# Altium schematic sheet P08 Hi3531AV100(DDRC0 D.SchDoc
size 420 x 297 mm
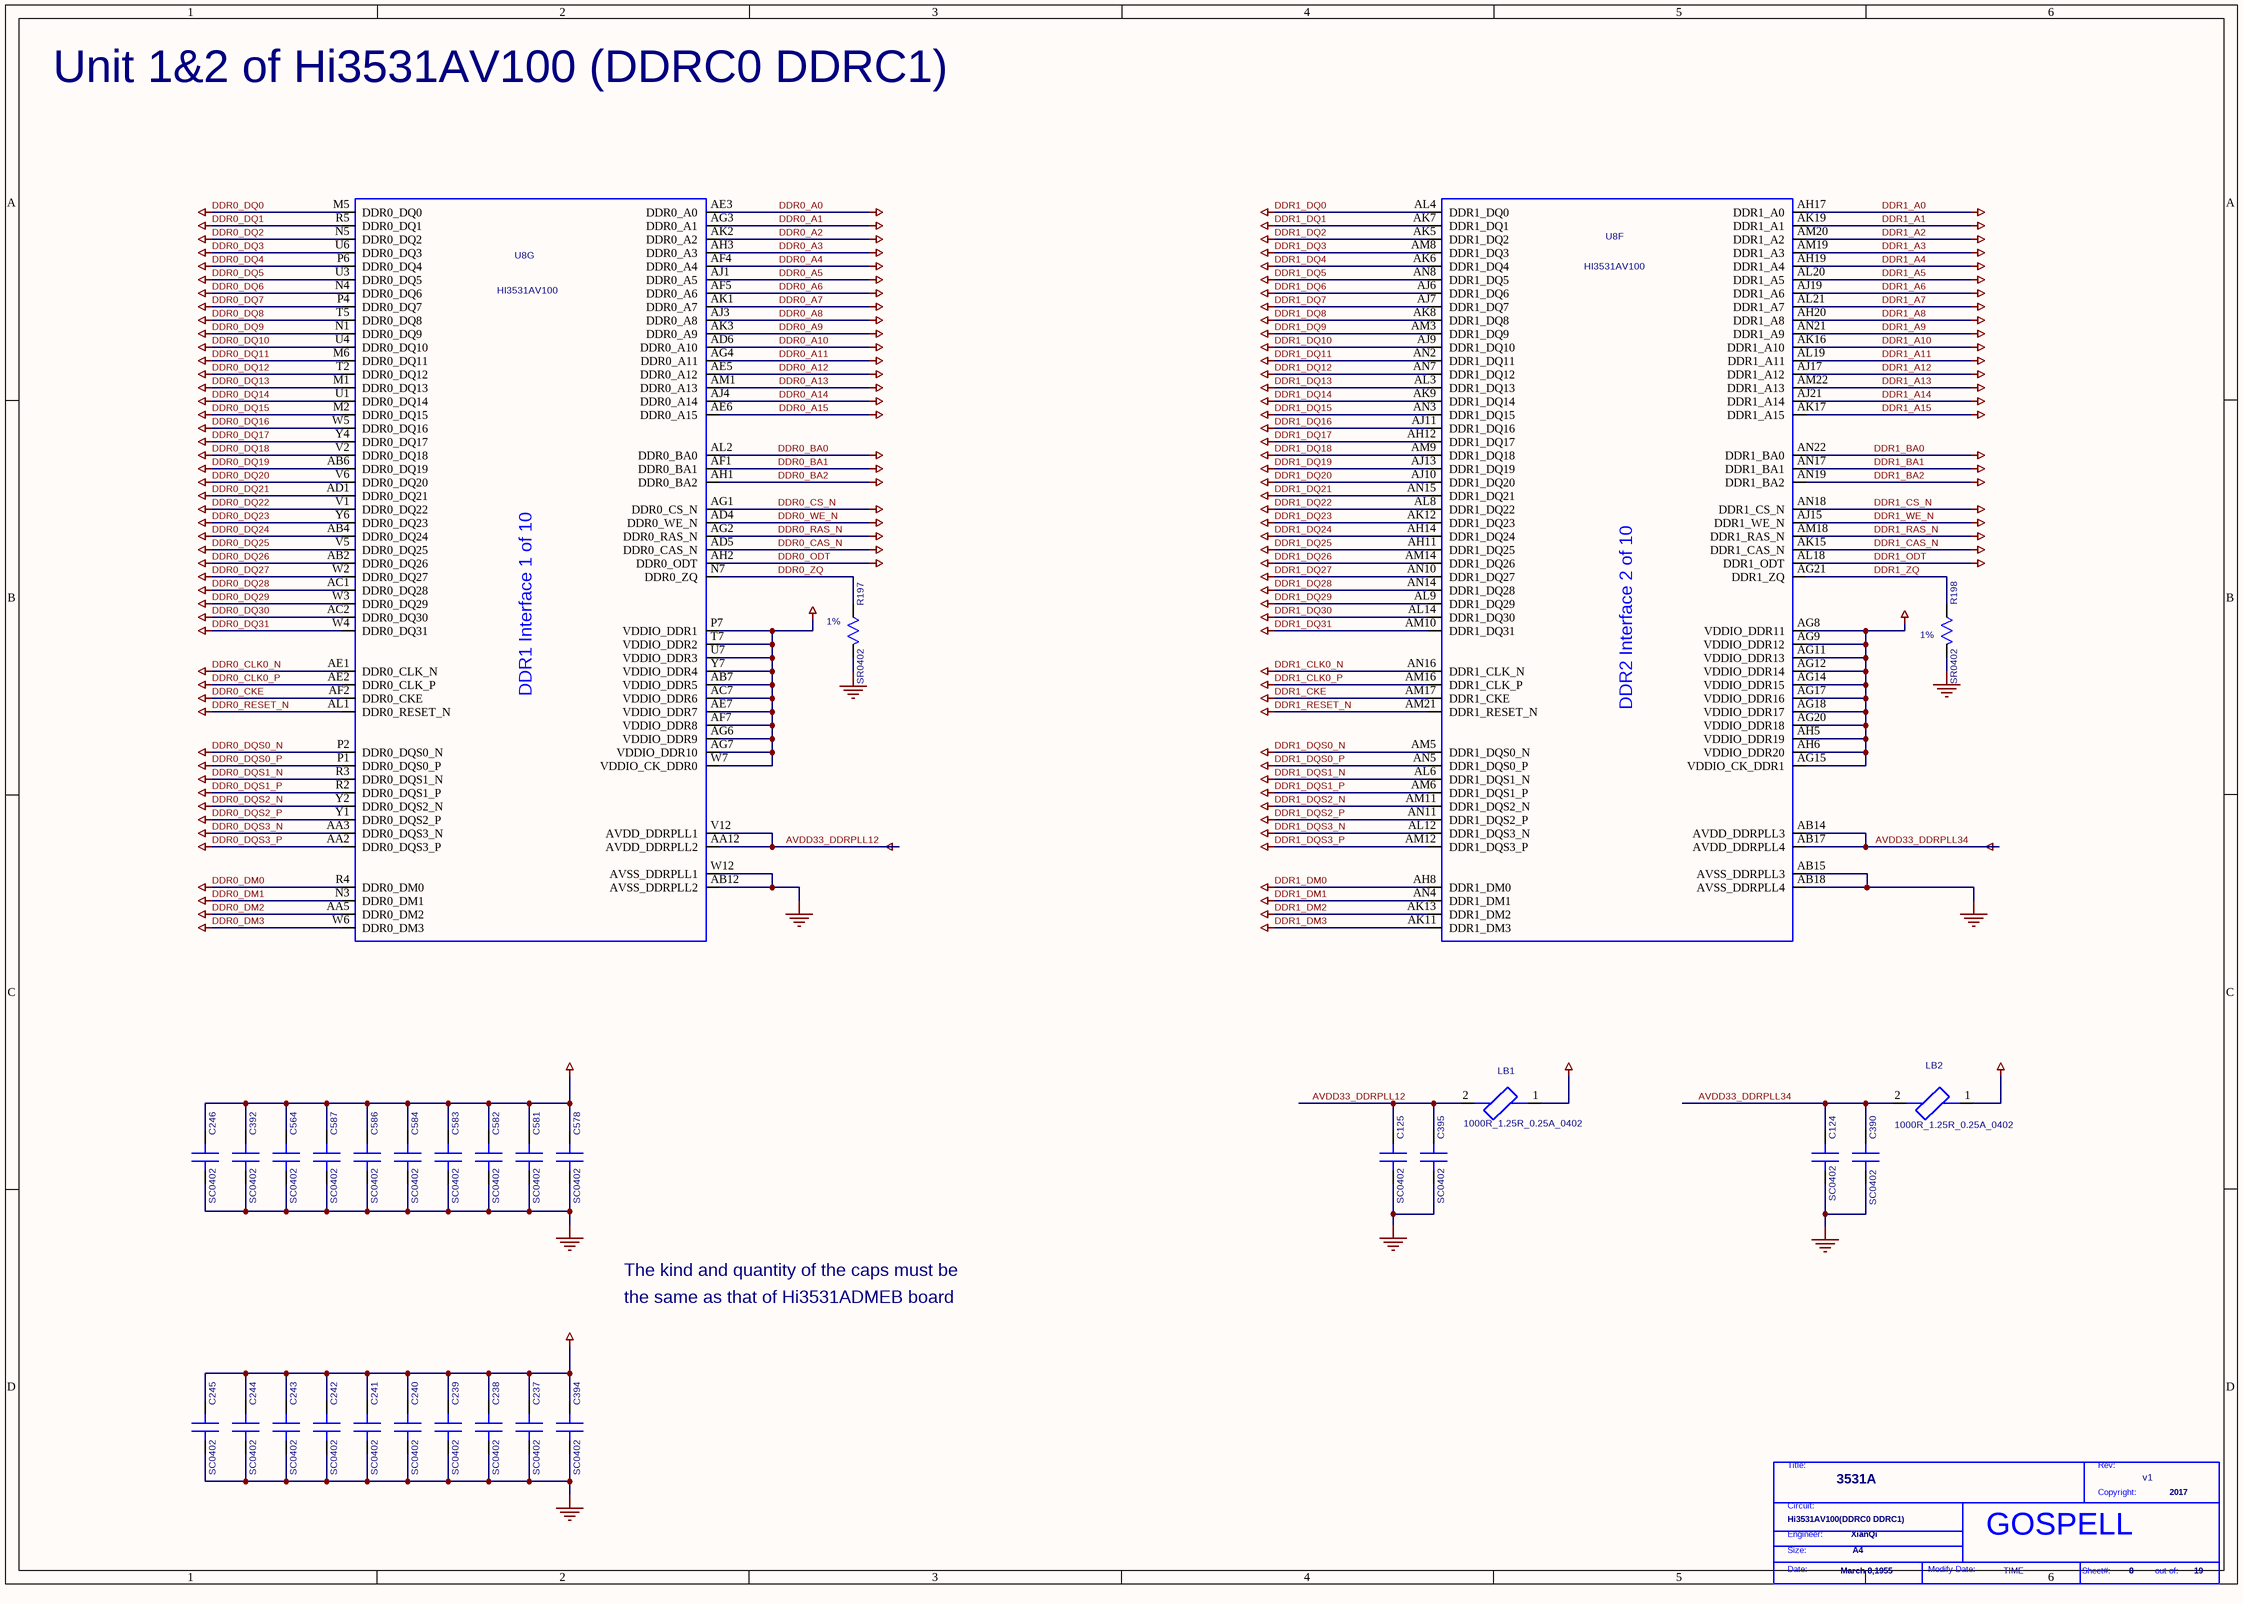
[diagram p0: P08 Hi3531AV100(DDRC0 D.SchDoc]

## Parts
*  Page Modify Date: TIME  Engineer: XianQi  Copyright: 2017  Title: 3531A  RevCode: v1  Page Size: A4  Page Create Date: March 8,1955  Page Number: 8  Page Count: 19  Doc: Hi3531AV100(DDRC0 DDRC1)  (hidden comment: GOSPELL)  (graphical)
C124  SC0402  [SC0402]
C125  SC0402  [SC0402]
C237  SC0402  [SC0402]
C238  SC0402  [SC0402]
C239  SC0402  [SC0402]
C240  SC0402  [SC0402]
C241  SC0402  [SC0402]
C242  SC0402  [SC0402]
C243  SC0402  [SC0402]
C244  SC0402  [SC0402]
C245  SC0402  [SC0402]
C246  SC0402  [SC0402]
C390  SC0402  [SC0402]
C392  SC0402  [SC0402]
C394  SC0402  [SC0402]
C395  SC0402  [SC0402]
C564  SC0402  [SC0402]
C578  SC0402  [SC0402]
C581  SC0402  [SC0402]
C582  SC0402  [SC0402]
C583  SC0402  [SC0402]
C584  SC0402  [SC0402]
C586  SC0402  [SC0402]
C587  SC0402  [SC0402]
LB1  SL0402  [SL0402]  (value not drawn)
LB2  SL0402  [SL0402]  (value not drawn)
R197  SR0402  [SR0402]
R198  SR0402  [SR0402]
U8  DEVICE: HI3531AV100  [BGA805-32-3333]  (hidden comment: BGA805-32-3333)  (parts F,G of 10)

## Nets
1V5: C237.1(A) C238.1(A) C239.1(A) C240.1(A) C241.1(A) C242.1(A) C243.1(A) C244.1(A) C245.1(A) C246.1(A) C392.1(A) C394.1(A) C564.1(A) C578.1(A) C581.1(A) C582.1(A) C583.1(A) C584.1(A) C586.1(A) C587.1(A) U8.AB7(VDDIO_DDR5) U8.AC7(VDDIO_DDR6) U8.AE7(VDDIO_DDR7) U8.AF7(VDDIO_DDR8) U8.AG6(VDDIO_DDR9) U8.AG7(VDDIO_DDR10) U8.AG8(VDDIO_DDR11) U8.AG9(VDDIO_DDR12) U8.AG11(VDDIO_DDR13) U8.AG12(VDDIO_DDR14) U8.AG14(VDDIO_DDR15) U8.AG15(VDDIO_CK_DDR1) U8.AG17(VDDIO_DDR16) U8.AG18(VDDIO_DDR17) U8.AG20(VDDIO_DDR18) U8.AH5(VDDIO_DDR19) U8.AH6(VDDIO_DDR20) U8.P7(VDDIO_DDR1) U8.T7(VDDIO_DDR2) U8.U7(VDDIO_DDR3) U8.W7(VDDIO_CK_DDR0) U8.Y7(VDDIO_DDR4)
3V3: LB1.1 LB2.1
AVDD33_DDRPLL12: C125.1(A) C395.1(A) LB1.2 U8.AA12(AVDD_DDRPLL2) U8.V12(AVDD_DDRPLL1)
AVDD33_DDRPLL34: C124.1(A) C390.1(A) LB2.2 U8.AB14(AVDD_DDRPLL3) U8.AB17(AVDD_DDRPLL4)
DDR0_A0: U8.AE3(DDR0_A0)
DDR0_A1: U8.AG3(DDR0_A1)
DDR0_A2: U8.AK2(DDR0_A2)
DDR0_A3: U8.AH3(DDR0_A3)
DDR0_A4: U8.AF4(DDR0_A4)
DDR0_A5: U8.AJ1(DDR0_A5)
DDR0_A6: U8.AF5(DDR0_A6)
DDR0_A7: U8.AK1(DDR0_A7)
DDR0_A8: U8.AJ3(DDR0_A8)
DDR0_A9: U8.AK3(DDR0_A9)
DDR0_A10: U8.AD6(DDR0_A10)
DDR0_A11: U8.AG4(DDR0_A11)
DDR0_A12: U8.AE5(DDR0_A12)
DDR0_A13: U8.AM1(DDR0_A13)
DDR0_A14: U8.AJ4(DDR0_A14)
DDR0_A15: U8.AE6(DDR0_A15)
DDR0_BA0: U8.AL2(DDR0_BA0)
DDR0_BA1: U8.AF1(DDR0_BA1)
DDR0_BA2: U8.AH1(DDR0_BA2)
DDR0_CAS_N: U8.AD5(DDR0_CAS_N)
DDR0_CKE: U8.AF2(DDR0_CKE)
DDR0_CLK0_N: U8.AE1(DDR0_CLK_N)
DDR0_CLK0_P: U8.AE2(DDR0_CLK_P)
DDR0_CS_N: U8.AG1(DDR0_CS_N)
DDR0_DM0: U8.R4(DDR0_DM0)
DDR0_DM1: U8.N3(DDR0_DM1)
DDR0_DM2: U8.AA5(DDR0_DM2)
DDR0_DM3: U8.W6(DDR0_DM3)
DDR0_DQ0: U8.M5(DDR0_DQ0)
DDR0_DQ1: U8.R5(DDR0_DQ1)
DDR0_DQ2: U8.N5(DDR0_DQ2)
DDR0_DQ3: U8.U6(DDR0_DQ3)
DDR0_DQ4: U8.P6(DDR0_DQ4)
DDR0_DQ5: U8.U3(DDR0_DQ5)
DDR0_DQ6: U8.N4(DDR0_DQ6)
DDR0_DQ7: U8.P4(DDR0_DQ7)
DDR0_DQ8: U8.T5(DDR0_DQ8)
DDR0_DQ9: U8.N1(DDR0_DQ9)
DDR0_DQ10: U8.U4(DDR0_DQ10)
DDR0_DQ11: U8.M6(DDR0_DQ11)
DDR0_DQ12: U8.T2(DDR0_DQ12)
DDR0_DQ13: U8.M1(DDR0_DQ13)
DDR0_DQ14: U8.U1(DDR0_DQ14)
DDR0_DQ15: U8.M2(DDR0_DQ15)
DDR0_DQ16: U8.W5(DDR0_DQ16)
DDR0_DQ17: U8.Y4(DDR0_DQ17)
DDR0_DQ18: U8.V2(DDR0_DQ18)
DDR0_DQ19: U8.AB6(DDR0_DQ19)
DDR0_DQ20: U8.V6(DDR0_DQ20)
DDR0_DQ21: U8.AD1(DDR0_DQ21)
DDR0_DQ22: U8.V1(DDR0_DQ22)
DDR0_DQ23: U8.Y6(DDR0_DQ23)
DDR0_DQ24: U8.AB4(DDR0_DQ24)
DDR0_DQ25: U8.V5(DDR0_DQ25)
DDR0_DQ26: U8.AB2(DDR0_DQ26)
DDR0_DQ27: U8.W2(DDR0_DQ27)
DDR0_DQ28: U8.AC1(DDR0_DQ28)
DDR0_DQ29: U8.W3(DDR0_DQ29)
DDR0_DQ30: U8.AC2(DDR0_DQ30)
DDR0_DQ31: U8.W4(DDR0_DQ31)
DDR0_DQS0_N: U8.P2(DDR0_DQS0_N)
DDR0_DQS0_P: U8.P1(DDR0_DQS0_P)
DDR0_DQS1_N: U8.R3(DDR0_DQS1_N)
DDR0_DQS1_P: U8.R2(DDR0_DQS1_P)
DDR0_DQS2_N: U8.Y2(DDR0_DQS2_N)
DDR0_DQS2_P: U8.Y1(DDR0_DQS2_P)
DDR0_DQS3_N: U8.AA3(DDR0_DQS3_N)
DDR0_DQS3_P: U8.AA2(DDR0_DQS3_P)
DDR0_ODT: U8.AH2(DDR0_ODT)
DDR0_RAS_N: U8.AG2(DDR0_RAS_N)
DDR0_RESET_N: U8.AL1(DDR0_RESET_N)
DDR0_WE_N: U8.AD4(DDR0_WE_N)
DDR1_A0: U8.AH17(DDR1_A0)
DDR1_A1: U8.AK19(DDR1_A1)
DDR1_A2: U8.AM20(DDR1_A2)
DDR1_A3: U8.AM19(DDR1_A3)
DDR1_A4: U8.AH19(DDR1_A4)
DDR1_A5: U8.AL20(DDR1_A5)
DDR1_A6: U8.AJ19(DDR1_A6)
DDR1_A7: U8.AL21(DDR1_A7)
DDR1_A8: U8.AH20(DDR1_A8)
DDR1_A9: U8.AN21(DDR1_A9)
DDR1_A10: U8.AK16(DDR1_A10)
DDR1_A11: U8.AL19(DDR1_A11)
DDR1_A12: U8.AJ17(DDR1_A12)
DDR1_A13: U8.AM22(DDR1_A13)
DDR1_A14: U8.AJ21(DDR1_A14)
DDR1_A15: U8.AK17(DDR1_A15)
DDR1_BA0: U8.AN22(DDR1_BA0)
DDR1_BA1: U8.AN17(DDR1_BA1)
DDR1_BA2: U8.AN19(DDR1_BA2)
DDR1_CAS_N: U8.AK15(DDR1_CAS_N)
DDR1_CKE: U8.AM17(DDR1_CKE)
DDR1_CLK0_N: U8.AN16(DDR1_CLK_N)
DDR1_CLK0_P: U8.AM16(DDR1_CLK_P)
DDR1_CS_N: U8.AN18(DDR1_CS_N)
DDR1_DM0: U8.AH8(DDR1_DM0)
DDR1_DM1: U8.AN4(DDR1_DM1)
DDR1_DM2: U8.AK13(DDR1_DM2)
DDR1_DM3: U8.AK11(DDR1_DM3)
DDR1_DQ0: U8.AL4(DDR1_DQ0)
DDR1_DQ1: U8.AK7(DDR1_DQ1)
DDR1_DQ2: U8.AK5(DDR1_DQ2)
DDR1_DQ3: U8.AM8(DDR1_DQ3)
DDR1_DQ4: U8.AK6(DDR1_DQ4)
DDR1_DQ5: U8.AN8(DDR1_DQ5)
DDR1_DQ6: U8.AJ6(DDR1_DQ6)
DDR1_DQ7: U8.AJ7(DDR1_DQ7)
DDR1_DQ8: U8.AK8(DDR1_DQ8)
DDR1_DQ9: U8.AM3(DDR1_DQ9)
DDR1_DQ10: U8.AJ9(DDR1_DQ10)
DDR1_DQ11: U8.AN2(DDR1_DQ11)
DDR1_DQ12: U8.AN7(DDR1_DQ12)
DDR1_DQ13: U8.AL3(DDR1_DQ13)
DDR1_DQ14: U8.AK9(DDR1_DQ14)
DDR1_DQ15: U8.AN3(DDR1_DQ15)
DDR1_DQ16: U8.AJ11(DDR1_DQ16)
DDR1_DQ17: U8.AH12(DDR1_DQ17)
DDR1_DQ18: U8.AM9(DDR1_DQ18)
DDR1_DQ19: U8.AJ13(DDR1_DQ19)
DDR1_DQ20: U8.AJ10(DDR1_DQ20)
DDR1_DQ21: U8.AN15(DDR1_DQ21)
DDR1_DQ22: U8.AL8(DDR1_DQ22)
DDR1_DQ23: U8.AK12(DDR1_DQ23)
DDR1_DQ24: U8.AH14(DDR1_DQ24)
DDR1_DQ25: U8.AH11(DDR1_DQ25)
DDR1_DQ26: U8.AM14(DDR1_DQ26)
DDR1_DQ27: U8.AN10(DDR1_DQ27)
DDR1_DQ28: U8.AN14(DDR1_DQ28)
DDR1_DQ29: U8.AL9(DDR1_DQ29)
DDR1_DQ30: U8.AL14(DDR1_DQ30)
DDR1_DQ31: U8.AM10(DDR1_DQ31)
DDR1_DQS0_N: U8.AM5(DDR1_DQS0_N)
DDR1_DQS0_P: U8.AN5(DDR1_DQS0_P)
DDR1_DQS1_N: U8.AL6(DDR1_DQS1_N)
DDR1_DQS1_P: U8.AM6(DDR1_DQS1_P)
DDR1_DQS2_N: U8.AM11(DDR1_DQS2_N)
DDR1_DQS2_P: U8.AN11(DDR1_DQS2_P)
DDR1_DQS3_N: U8.AL12(DDR1_DQS3_N)
DDR1_DQS3_P: U8.AM12(DDR1_DQS3_P)
DDR1_ODT: U8.AL18(DDR1_ODT)
DDR1_RAS_N: U8.AM18(DDR1_RAS_N)
DDR1_RESET_N: U8.AM21(DDR1_RESET_N)
DDR1_WE_N: U8.AJ15(DDR1_WE_N)
GND: C124.2(B) C125.2(B) C237.2(B) C238.2(B) C239.2(B) C240.2(B) C241.2(B) C242.2(B) C243.2(B) C244.2(B) C245.2(B) C246.2(B) C390.2(B) C392.2(B) C394.2(B) C395.2(B) C564.2(B) C578.2(B) C581.2(B) C582.2(B) C583.2(B) C584.2(B) C586.2(B) C587.2(B) R197.2(B) R198.2(B) U8.AB12(AVSS_DDRPLL2) U8.AB15(AVSS_DDRPLL3) U8.AB18(AVSS_DDRPLL4) U8.W12(AVSS_DDRPLL1)
DDR0_ZQ: R197.1(A) U8.N7(DDR0_ZQ)
DDR1_ZQ: R198.1(A) U8.AG21(DDR1_ZQ)

## Notes on the sheet
- Unit 1&2 of Hi3531AV100 (DDRC0 DDRC1)
- (near R197) 1%
- (near R198) 1%
- (near LB1) 1000R_1.25R_0.25A_0402
- (near LB2) 1000R_1.25R_0.25A_0402
- the same as that of Hi3531ADMEB board
- The kind and quantity of the caps must be
- (in symbol GOSPELL) Title:; Rev:; Copyright:; Circuit:; Engineer:; Size:; Date:; Modify Date:; Sheet#:; out of:
- (in symbol HI3531AV100_M2_17, part F) DDR2 Interface 2 of 10
- (in symbol HI3531AV100_M2_17, part G) DDR1 Interface 1 of 10

## Library data of the parts
C124 = C_0_Dup2: PARTS: 1; PINSWAP: (A,B); LEVEL: STD; DEVICE: RMEMK105BJ104KV_FR; OriginalSymbolOrigin: (0,30); %208%%161%%192%%224%%195%%251%%179%%198%: SMD陶瓷电容; COMPONENT_HIGH_MAX: 0.6MM; %182%%238%%182%%168%%185%%164%%215%%247%%181%%231%%209%%185%(V): 16; %195%%232%%202%%246%: SMD陶瓷电容-16V-100NF-+/-10%-X7R-0402-BT; CODE: 8070614; PKG_TYPE: SC0402
C125 = C_0_Dup2: PARTS: 1; PINSWAP: (A,B); LEVEL: STD; DEVICE: RMEMK105BJ104KV_FR; OriginalSymbolOrigin: (0,30); CODE: 8070614; %195%%232%%202%%246%: SMD陶瓷电容-16V-100NF-+/-10%-X7R-0402-BT; %182%%238%%182%%168%%185%%164%%215%%247%%181%%231%%209%%185%(V): 16; COMPONENT_HIGH_MAX: 0.6MM; %208%%161%%192%%224%%195%%251%%179%%198%: SMD陶瓷电容; PKG_TYPE: SC0402
C237 C239 C241 C243 C245 C390 C392 C394 C578 C582 C584 C587 = C_0_Dup2: PARTS: 1; PINSWAP: (A,B); LEVEL: STD; DEVICE: CV05X5R105K10AH; OriginalSymbolOrigin: (0,30); CODE: 8070612; %195%%232%%202%%246%: SMD陶瓷电容-10V-1000NF-+/-10%-X5R-0402-BT,TS16949; %182%%238%%182%%168%%185%%164%%215%%247%%181%%231%%209%%185%(V): 10; COMPONENT_HIGH_MAX: 0.55MM; %208%%161%%192%%224%%195%%251%%179%%198%: SMD陶瓷电容; PKG_TYPE: SC0402
C238 C240 C242 C244 C246 C395 C564 C581 C583 C586 = C_0_Dup2: PARTS: 1; PINSWAP: (A,B); LEVEL: STD; DEVICE: CV05X5R105K10AH; OriginalSymbolOrigin: (0,30); %208%%161%%192%%224%%195%%251%%179%%198%: SMD陶瓷电容; COMPONENT_HIGH_MAX: 0.55MM; %182%%238%%182%%168%%185%%164%%215%%247%%181%%231%%209%%185%(V): 10; %195%%232%%202%%246%: SMD陶瓷电容-10V-1000NF-+/-10%-X5R-0402-BT,TS16949; CODE: 8070612; PKG_TYPE: SC0402
LB1 LB2 = LB_0: PARTS: 1; DEVICE: BLM15HG102SN1D; LEVEL: STD; OriginalSymbolOrigin: (20,50); CODE: 10070019; %195%%232%%202%%246%: EMI磁珠-+/-25%-1000OHM-1.25OHM-0.25A-0402-1400OHM@1GHZ-1400OHM@1GHZ; COMPONENT_HIGH_MAX: 0.55MM; %208%%161%%192%%224%%195%%251%%179%%198%: EMI磁珠; PKG_TYPE: SL0402
R197 R198 = R_1: PARTS: 1; LEVEL: STD; DEVICE: RC0402FR_07240RL; PINSWAP: (A,B); OriginalSymbolOrigin: (10,20); CODE: 7091782; %195%%232%%202%%246%: 片式厚膜电阻器-0.0625W-240OHM-+/- 1%-0402-BT; %182%%238%%182%%168%%185%%166%%194%%202%(W): 0.06; %215%%232%%214%%181%%212%%202%%208%%237%%198%%171%%178%%238%: +/- 1%; COMPONENT_HIGH_MAX: 0.4MM; %208%%161%%192%%224%%195%%251%%179%%198%: 片式厚膜电阻器; PKG_TYPE: SR0402
U8 = HI3531AV100_M2_17: FORWARD_PCB: 1; HETERO: (HI3531AV100_DDR1),(HI3531AV100_DDR2),(HI3531AV100_SYSTEM),(HI3531AV100_AD),(HI3531AV100_VO),(HI3531AV100_M1),(HI3531AV100_M2),(HI3531AV100_POWER),(HI3531AV100_VSS1),(HI3531AV100_VSS2); LEVEL: STD; OriginalSymbolOrigin: (30,630); CODE: 35020607; CaptureCellPackProp: HI3531AV100_M2F; PARTS: 1; PKG_TYPE: BGA805-32-3333